# Altium schematic sheet SH3 - CAN.SchDoc: CAN
size 279 x 215 mm; CheckedBy: Lance Bantoto; Engineer: Taylor McNabb; Revision: 1; SheetNumber: 3; SheetTotal: 4
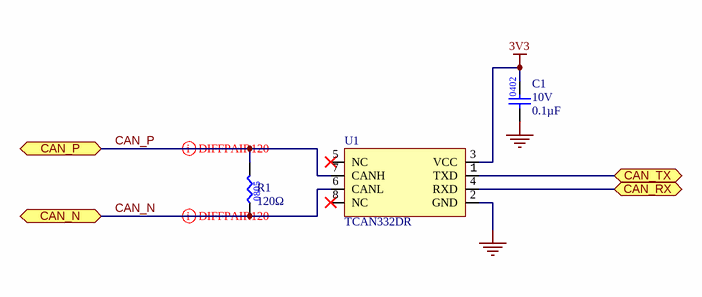
[diagram p0: SH3 - CAN.SchDoc]

## Parts
C1  value 0.1µF  Voltage Rating: 10V  [CAP0402]  (hidden comment: CAP_0.1uF_10V_0402)
R1  value 120Ω  [RES0805]  (hidden comment: RES_120Ω_0805_1%)
U1  IC_CAN_TRANSCEIVER_1MBPS  [TCAN332DR]  (value not drawn)

## Ports
CAN_N (bidir), CAN_P (bidir), CAN_RX (bidir), CAN_TX (bidir)

## Nets
3V3: C1.2 U1.3(VCC)
GND: C1.1 U1.2(GND)
CAN_N: R1.1 U1.6(CANL) ; port CAN_N
CAN_P: R1.2 U1.7(CANH) ; port CAN_P
CAN_RX: U1.4(RXD) ; port CAN_RX
CAN_TX: U1.1(TXD) ; port CAN_TX

Not connected (* = marked no-connect by the designer): U1 5(NC)* 8(NC)*

## Layout directives
differential pair: CAN_N, CAN_P

## Notes on the sheet
- University of Waterloo Robotics Team
- 200 University Ave W
- REV
- PROJECT
- Waterloo, Ontario, Canada
- N2L 3G1
- DOCUMENT
- ENGINEER
- REVIEWER
- MODIFIED
- SHEET
- OF

## Library data of the parts
C1 = CAP_0.1uF_10V_0402: CAP CER 0.1UF 10V X7R 0402; Manufacturer 1: Murata Electronics; Manufacturer Part Number 1: GRM155R71A104KA01D; Package/Footprint: 0402; Supplier 1: Digi-Key; Supplier Part Number 1: 490-6321-1-ND
R1 = RES_120Ω_0805_1%: RES 120 OHM 1% 1/8W 0805; Manufacturer 1: Vishay; Manufacturer Part Number 1: CRCW0805120RFKEA; Package/Footprint: 0805; Supplier Part Number 1: 541-120CCT-ND; Supplier 1: Digi-Key; LCSC Part #: C17437; Mounting Type: SMD
U1 = IC_CAN_TRANSCEIVER_1MBPS: IC TXRX CAN 1MBPS 8SOIC; Manufacturer 1: Texas Instruments; Voltage - Supply: 3V ~ 3.6V; Package/Footprint: 8-SOIC; Receiver Hysteresis: 120 mV; ComponentLink1Description: New link; ComponentLink1URL: *; Supplier 1: Digi-Key; Supplier Part Number 1: 296-43711-1-ND; Data Rate: 1Mbps; Operating Temperature: -40°C ~ 125°C; Mounting Type: Surface Mount; Manufacturer Part Number 1: TCAN332DR